# Altium schematic sheet Transmitter.SchDoc
size B; SheetNumber: 1; SheetTotal: 8
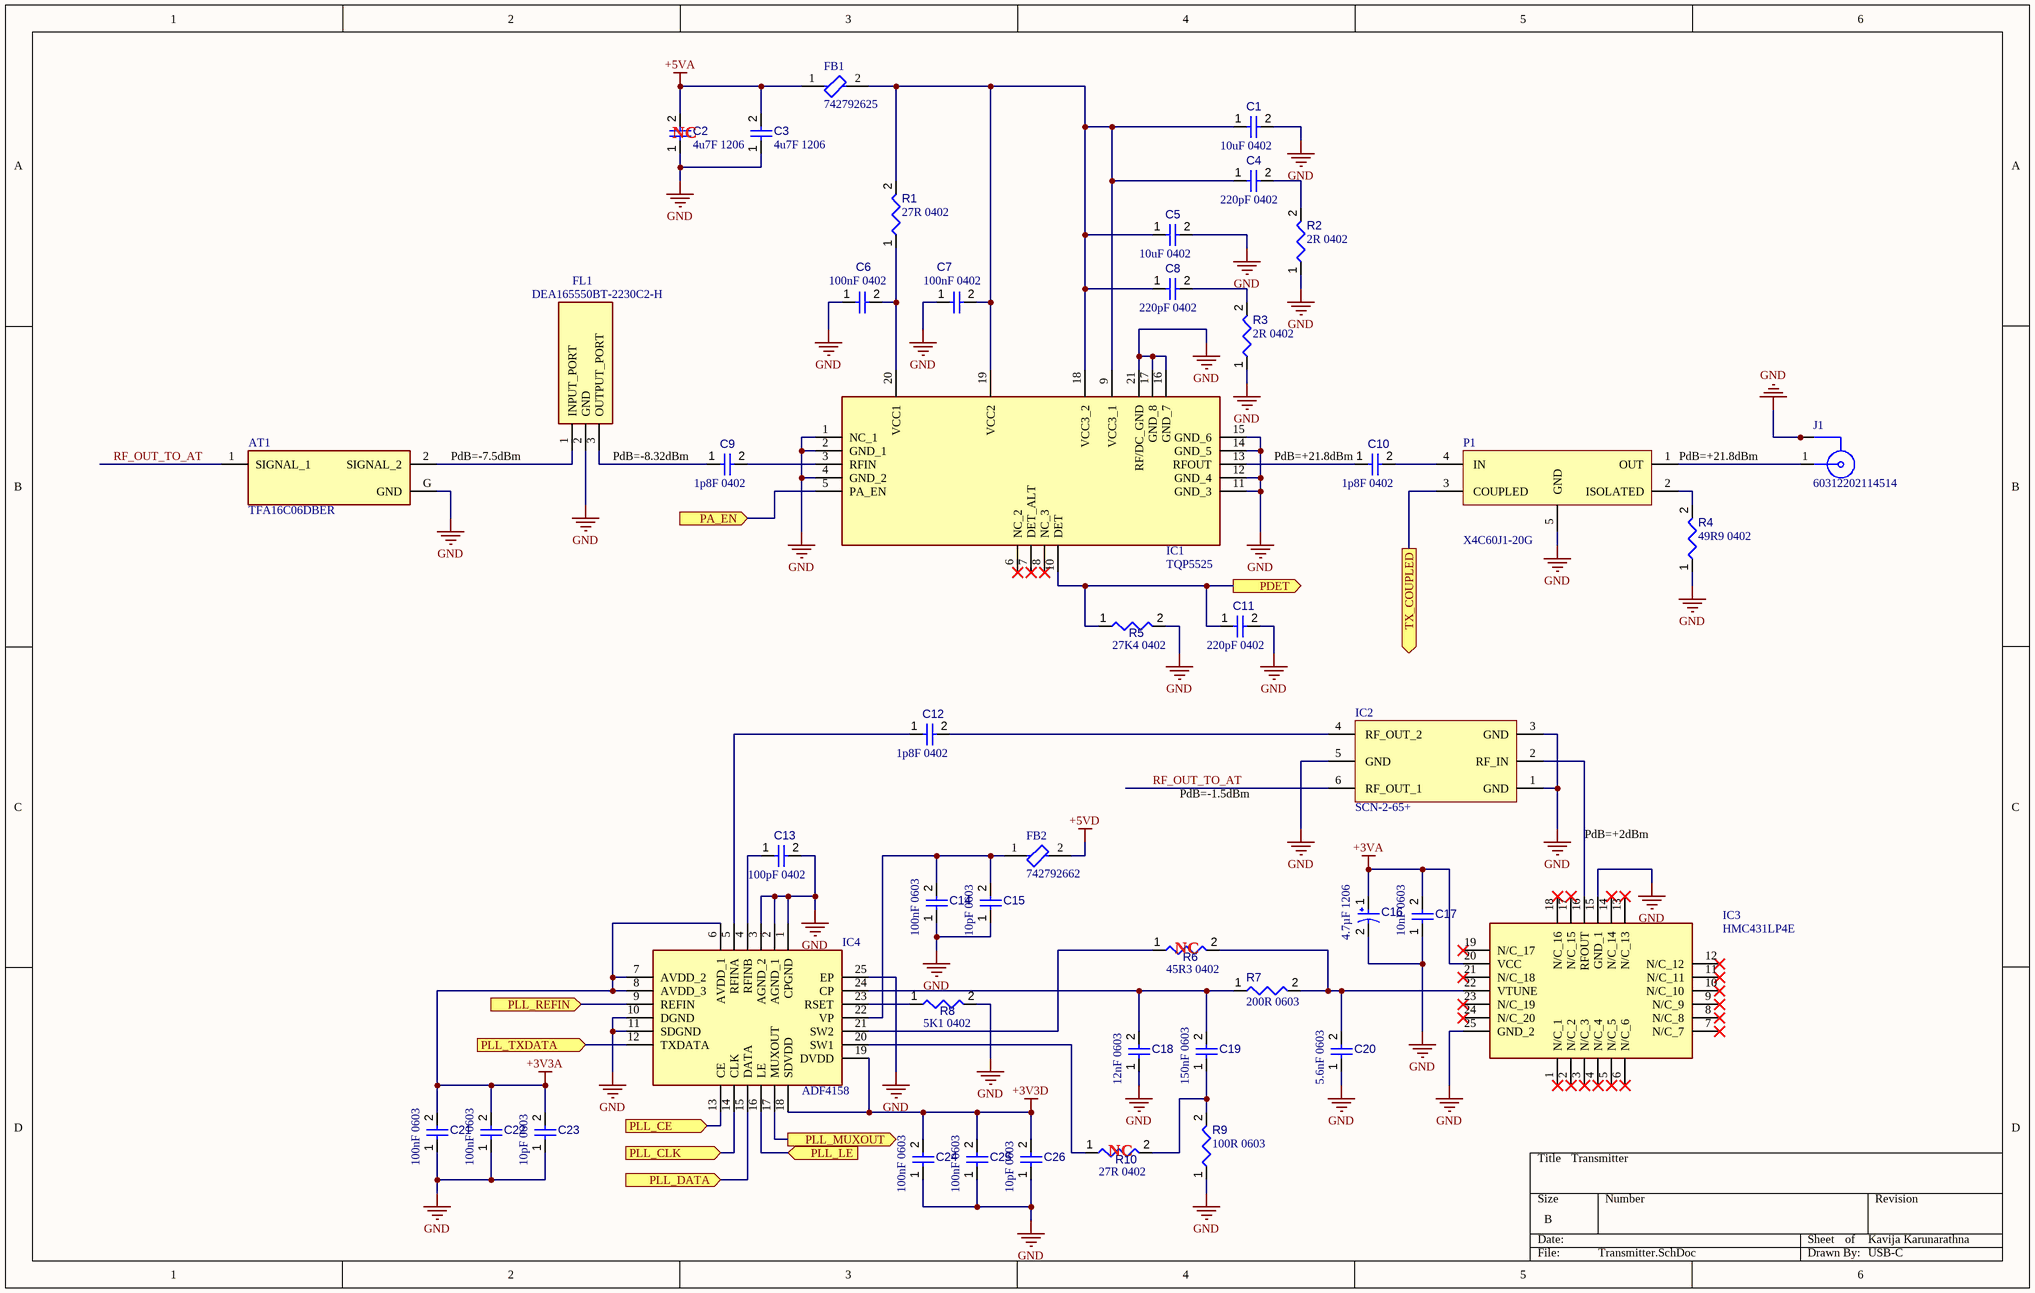
[diagram p0: Transmitter.SchDoc]

## Parts
AT1  TFA16C06DBER  [ATTN_TFA16C06DBER]
C1  value 10uF 0402  [CAPC0402(1005)60_L]  (hidden comment: Capacitor 10uF +/-10% 0402)
C2  value 4u7F 1206  [CAPC3216X180X50NL20T25]  (hidden comment: Capacitor 4.7 uF +/- 10% 60 V 1206)
C3  value 4u7F 1206  [CAPC3216X180X50NL20T25]  (hidden comment: Capacitor 4.7 uF +/- 10% 60 V 1206)
C4  value 220pF 0402  [CAPC0402(1005)60_L]  (hidden comment: Capacitor 220pF +/-10% 0402)
C5  value 10uF 0402  [CAPC0402(1005)60_L]  (hidden comment: Capacitor 10uF +/-10% 0402)
C6  value 100nF 0402  [CAPC0402(1005)60_L]  (hidden comment: Capacitor 100nF +/-10% 0402)
C7  value 100nF 0402  [CAPC0402(1005)60_L]  (hidden comment: Capacitor 100nF +/-10% 0402)
C8  value 220pF 0402  [CAPC0402(1005)60_L]  (hidden comment: Capacitor 220pF +/-10% 0402)
C9  value 1p8F 0402  [CAPC0402(1005)60_L]  (hidden comment: Capacitor 47nF +/-20% 50V 0402)
C10  value 1p8F 0402  [CAPC0402(1005)60_L]  (hidden comment: Capacitor 47nF +/-20% 50V 0402)
C11  value 220pF 0402  [CAPC0402(1005)60_L]  (hidden comment: Capacitor 220pF +/-10% 0402)
C12  value 1p8F 0402  [CAPC0402(1005)60_L]  (hidden comment: Capacitor 47nF +/-20% 50V 0402)
C13  value 100pF 0402  [CAPC0402(1005)60_L]  (hidden comment: Capacitor 47nF +/-20% 50V 0402)
C14  value 100nF 0603  [CAPC0603(1608)100_L]  (hidden comment: Capacitor 1µF +/-0.1% 25V 0603)
C15  value 10pF 0603  [CAPC0603(1608)100_L]  (hidden comment: Capacitor 1µF +/-0.1% 25V 0603)
C16  value 4.7µF 1206  [AVX-TAJ-A-2_L]  (hidden comment: TAJA475K016RNJ)
C17  value 10nF 0603  [CAPC0603(1608)100_L]  (hidden comment: Capacitor 1µF +/-0.1% 25V 0603)
C18  value 12nF 0603  [CAPC0603(1608)100_L]  (hidden comment: Capacitor 12nF +/-1% 0603)
C19  value 150nF 0603  [CAPC0603(1608)100_L]  (hidden comment: Capacitor 150nF +/-5% 25V 0603)
C20  value 5.6nF 0603  [CAPC0603(1608)100_L]  (hidden comment: Capacitor 1µF +/-0.1% 25V 0603)
C21  value 100nF 0603  [CAPC0603(1608)100_L]  (hidden comment: Capacitor 1µF +/-0.1% 25V 0603)
C22  value 100nF 0603  [CAPC0603(1608)100_L]  (hidden comment: Capacitor 1µF +/-0.1% 25V 0603)
C23  value 10pF 0603  [CAPC0603(1608)100_L]  (hidden comment: Capacitor 1µF +/-0.1% 25V 0603)
C24  value 100nF 0603  [CAPC0603(1608)100_L]  (hidden comment: Capacitor 1µF +/-0.1% 25V 0603)
C25  value 100nF 0603  [CAPC0603(1608)100_L]  (hidden comment: Capacitor 1µF +/-0.1% 25V 0603)
C26  value 10pF 0603  [CAPC0603(1608)100_L]  (hidden comment: Capacitor 1µF +/-0.1% 25V 0603)
FB1  742792625  [FB-0603]
FB2  742792662  [FB-0603]
FL1  DEA165550BT-2230C2-H  [DEA165550BT-2230C2-H]
IC1  TQP5525  [QPA9501TR13]
IC2  SCN-2-65+  [SCN-2-65+]
IC3  HMC431LP4E  [QFN50P400X400X100-25N]
IC4  ADF4158  [QFN50P400X400X80-25N-D]
J1  60312202114514  [60312202114514]
P1  X4C60J1-20G  [X4C60J1-20G]
R1  value 27R 0402  [RESC0402(1005)_L]  (hidden comment: 383KR2F)
R2  value 2R 0402  [RESC0402(1005)_L]  (hidden comment: 383KR2F)
R3  value 2R 0402  [RESC0402(1005)_L]  (hidden comment: 383KR2F)
R4  value 49R9 0402  [RESC0402(1005)_L]  (hidden comment: 383KR2F)
R5  value 27K4 0402  [RESC0402(1005)_L]  (hidden comment: 383KR2F)
R6  value 45R3 0402  [RESC0402(1005)_L]  (hidden comment: 383KR2F)
R7  value 200R 0603  [RESC0603(1608)_L]  (hidden comment: 120R3J)
R8  value 5K1 0402  [RESC0402(1005)_L]  (hidden comment: 383KR2F)
R9  value 100R 0603  [RESC0603(1608)_L]  (hidden comment: 120R3J)
R10  value 27R 0402  [RESC0402(1005)_L]  (hidden comment: 383KR2F)

## Ports
PA_EN (in, see MCU[3A]), PDET (out, see MCU[3C]), PLL_CE (in, see MCU[3A]), PLL_CLK (in, see MCU[2B]), PLL_DATA (in, see MCU[2B]), PLL_LE (in, see MCU[2C]), PLL_MUXOUT (out, see MCU[2B]), PLL_REFIN (in, see MCU[3D]), PLL_TXDATA (in, see MCU[2C]), TX_COUPLED (out, see Mixer[1C])

## Nets
+3V3A: C21.2 C22.2 C23.2 IC4.6(AVDD_1) IC4.7(AVDD_2) IC4.8(AVDD_3)
+3V3D: C24.2 C25.2 C26.2 IC4.18(SDVDD) IC4.19(DVDD)
+3VA: C16.1 C17.2 IC3.20(VCC)
+5VA: C2.2 C3.2 FB1.1
+5VD: FB2.2
GND: AT1.G(GND) C1.2 C2.1 C3.1 C5.2 C6.1 C7.1 C11.2 C13.2 C14.1 C15.1 C16.2 C17.1 C18.1 C20.1 C21.1 C22.1 C23.1 C24.1 C25.1 C26.1 FL1.2(GND) IC1.1(NC_1) IC1.2(GND_1) IC1.4(GND_2) IC1.11(GND_3) IC1.12(GND_4) IC1.14(GND_5) IC1.15(GND_6) IC1.16(GND_7) IC1.17(GND_8) IC1.21(RF/DC_GND) IC2.1(GND) IC2.3(GND) IC2.5(GND) IC3.15(GND_1) IC3.25(GND_2) IC4.1(CPGND) IC4.2(AGND_1) IC4.3(AGND_2) IC4.10(DGND) IC4.11(SDGND) IC4.25(EP) J1.2 J1.3 J1.4 J1.5 P1.5(GND) R2.1 R3.1 R4.1 R5.2 R8.2 R9.1
PA_EN: IC1.5(PA_EN) ; port PA_EN
PDET: C11.1 IC1.10(DET) R5.1 ; port PDET
PLL_CE: IC4.13(CE) ; port PLL_CE
PLL_CLK: IC4.14(CLK) ; port PLL_CLK
PLL_DATA: IC4.15(DATA) ; port PLL_DATA
PLL_LE: IC4.16(LE) ; port PLL_LE
PLL_MUXOUT: IC4.17(MUXOUT) ; port PLL_MUXOUT
PLL_REFIN: IC4.9(REFIN) ; port PLL_REFIN
PLL_TXDATA: IC4.12(TXDATA) ; port PLL_TXDATA
RF_OUT_TO_AT: AT1.1(SIGNAL_1) IC2.6(RF_OUT_1)
TX_COUPLED: P1.3(COUPLED) ; port TX_COUPLED
NetAT1_2: AT1.2(SIGNAL_2) FL1.1(INPUT_PORT)
NetC1_1: C1.1 C4.1 C5.1 C7.2 C8.1 FB1.2 IC1.9(VCC3_1) IC1.18(VCC3_2) IC1.19(VCC2) R1.2
NetC4_2: C4.2 R2.2
NetC6_2: C6.2 IC1.20(VCC1) R1.1
NetC8_2: C8.2 R3.2
NetC9_1: C9.1 FL1.3(OUTPUT_PORT)
NetC9_2: C9.2 IC1.3(RFIN)
NetC10_1: C10.1 IC1.13(RFOUT)
NetC10_2: C10.2 P1.4(IN)
NetC12_1: C12.1 IC4.5(RFINA)
NetC12_2: C12.2 IC2.4(RF_OUT_2)
NetC13_1: C13.1 IC4.4(RFINB)
NetC14_2: C14.2 C15.2 FB2.1 IC4.22(VP)
NetC18_2: C18.2 C19.2 IC4.24(CP) R7.1
NetC19_1: C19.1 R9.2 R10.2
NetC20_2: C20.2 IC3.22(VTUNE) R6.2 R7.2
NetIC2_2: IC2.2(RF_IN) IC3.16(RFOUT)
NetIC4_20: IC4.20(SW1) R10.1
NetIC4_21: IC4.21(SW2) R6.1
NetIC4_23: IC4.23(RSET) R8.1
NetJ1_1: J1.1 P1.1(OUT)
NetP1_2: P1.2(ISOLATED) R4.2

Not connected (* = marked no-connect by the designer): IC1 6(NC_2)* 7(DET_ALT)* 8(NC_3)*; IC3 1(N/C_1)* 2(N/C_2)* 3(N/C_3)* 4(N/C_4)* 5(N/C_5)* 6(N/C_6)* 7(N/C_7)* 8(N/C_8)* 9(N/C_9)* 10(N/C_10)* 11(N/C_11)* 12(N/C_12)* 13(N/C_13)* 14(N/C_14)* 17(N/C_15)* 18(N/C_16)* 19(N/C_17)* 21(N/C_18)* 23(N/C_19)* 24(N/C_20)*

## Notes on the sheet
- (near C2) NC
- PdB=-7.5dBm
- PdB=-8.32dBm
- (near C10) PdB=+21.8dBm
- (near P1) PdB=+21.8dBm
- PdB=-1.5dBm
- PdB=+2dBm
- (near R6) NC
- (near R10) NC
- Transmitter
- Kavija Karunarathna
- USB-C

## Library data of the parts
AT1 = CMP-379-000000-3: RF ATTENUATOR0603 RF ATTENUATOR; MF: Ohmite; Design Item ID: TFA16C06DBER; Value: *; Check_prices: https://www.snapeda.com/parts/TFA16C06DBER/Ohmite/view-part/?ref=eda; SnapEDA_Link: https://www.snapeda.com/parts/TFA16C06DBER/Ohmite/view-part/?ref=snap; Component Type: Standard; Package: None; Source: TFA16C06DBER.SchLib; Pin Count: 3; Manufacturer Part No: TFA16C06DBER; Mouser Part No: 588-TFA16C06DBER
C1 C5 = CMP-001-00071-4: Multilayer Ceramic Capacitors MLCC - SMD/SMT KGM05CR50G106MH NEW GLOBAL PN 4V 10uF X5 A 581-KGM05CR50G106MH; Manufacturer Part No: 04024D106MAT2A; Voltage Rating: 50V; Tolerance: 20%; Pins: 2; Mounting Technology: SMT; Case/Package: 0402; Max Operating Temperature: 85°C; Min Operating Temperature: -55°C; Mouser Part No: 581-04024D106MAT2A
C2 C3 = CMP-001-00016-6: Multilayer Ceramic Capacitors MLCC - SMD/SMT 50V 4.7uF X7R 1206 10% HI CV; Manufacturer Part No: CC1206KFX7R9BB475; Tolerance: 10%; Min Operating Temperature: -55°C; Capacitor Type: Ceramic; Voltage Rating: 50V; Pins: 2; Mounting Technology: SM; Case/Package: 1206; Max Operating Temperature: 125°C; RoHS Compliant: True; Mouser Part No: 603-CC1206KFX7R9B475
C4 C8 C11 = CMP-001-00071-4: Multilayer Ceramic Capacitors MLCC - SMD/SMT VJ 0402 C0G 221 0.1 Ni barrier 50V Unmarked 7" reel; Manufacturer Part No: VJ0402A221KXAAC; Tolerance: 20%; Pins: 2; Mounting Technology: SMT; Voltage Rating: 50V; Case/Package: 0402; Max Operating Temperature: 85°C; Min Operating Temperature: -55°C; Mouser Part No: 77-VJ0402A221KXAAC
C6 C7 = CMP-001-00071-4: Multilayer Ceramic Capacitors MLCC - SMD/SMT 25V .1uF X7R 0402 10 % -62C Storage Temp; Manufacturer Part No: 04023C104KAT2A-62; Voltage Rating: 50V; Tolerance: 20%; Pins: 2; Mounting Technology: SMT; Case/Package: 0402; Max Operating Temperature: 85°C; Min Operating Temperature: -55°C; Mouser Part No: 581-04023C104KAT2A62
C9 C10 C12 = CMP-001-00071-4: Multilayer Ceramic Capacitors MLCC - SMD/SMT 50 V 10 pF C0G 0402 1%; Manufacturer Part No: GJM1555C1H1R8CB01J; Tolerance: 20%; Pins: 2; Mounting Technology: SMT; Voltage Rating: 50V; Case/Package: 0402; Max Operating Temperature: 85°C; Min Operating Temperature: -55°C; Mouser Part No: 81-GJM1555C1H1R8CB1J
C13 = CMP-001-00071-4: Chip Capacitor, 47nF +/-20%, 50V, 0402, Thickness 0.6 mm; Manufacturer Part No: 0402X7R101KT2AT; Tolerance: 20%; Pins: 2; Mounting Technology: SMT; Voltage Rating: 50V; Case/Package: 0402; Max Operating Temperature: 85°C; Min Operating Temperature: -55°C; Mouser Part No: 581-0402X7R101KT2AT
C14 C21 C22 C24 C25 = CMP-001-00055-4: Chip Capacitor, 1µF +/-0.1%, 25V, 0603, Thickness 1 mm; Manufacturer Part No: 0603X104K250CT; Tolerance: 20%; Min Operating Temperature: -55°C; Max Operating Temperature: 85°C; Voltage Rating: 25V; Mounting Technology: SMT; Case/Package: 0603; Pins: 2; Mouser Part No: 791-0603X104K250CT
C15 C23 C26 = CMP-001-00055-4: Chip Capacitor, 1µF +/-0.1%, 25V, 0603, Thickness 1 mm; Manufacturer Part No: VJ0603A100JXBAP; Tolerance: 20%; Min Operating Temperature: -55°C; Max Operating Temperature: 85°C; Voltage Rating: 25V; Mounting Technology: SMT; Case/Package: 0603; Pins: 2; Mouser Part No: 77-VJ0603A100JXBAP
C16 = CMP-001-00042-7: Tantalum Capacitors - Solid SMD 20V 4.7uF 1206 10% ESR=4ohms; Manufacturer: AVX; Manufacturer Part No: T491A475K020AT; Resistance: 4Ohm; Voltage Rating: 16V; Max Operating Temperature: 125°C; Case/Package: 1206; Package Description: 2-Pin Surface Mount Device, Body 3.2 x 1.65 mm; Min Operating Temperature: -55°C; RoHS Compliant: True; Package Reference: TAJ-A-2; ESR: 4Ohm; Capacitor Type: Tantalum; Packaging: TapeandReel; Datasheet Version: Feb-16; Tolerance: 10%; Mounting Technology: SM; Package Quantity: 2000; Mouser Part No: 80-T491A475K020
C17 = CMP-001-00055-4: Multilayer Ceramic Capacitors MLCC - SMD/SMT 0603 10nF 16volts X7R 10%; Manufacturer Part No: VJ0603Y103KXJAC31X; Tolerance: 20%; Min Operating Temperature: -55°C; Max Operating Temperature: 85°C; Voltage Rating: 25V; Mounting Technology: SMT; Case/Package: 0603; Pins: 2; Mouser Part No: 77-V0603Y103KXJAC31X
C18 = CMP-001-00055-4: Multilayer Ceramic Capacitors MLCC - SMD/SMT Cap Cer 0603 12nF 16VDC X8G 1%; Manufacturer Part No: C0603C123F4TACTU; Tolerance: 20%; Voltage Rating: 25V; Min Operating Temperature: -55°C; Max Operating Temperature: 85°C; Mounting Technology: SMT; Case/Package: 0603; Pins: 2; Mouser Part No: 80-C0603C123F4TACTU
C19 = CMP-001-00055-4: Multilayer Ceramic Capacitors MLCC - SMD/SMT 10V .15uF X7R 0603 5 %; Manufacturer Part No: 0603ZC154JAT2A; Tolerance: 20%; Min Operating Temperature: -55°C; Max Operating Temperature: 85°C; Voltage Rating: 25V; Mounting Technology: SMT; Case/Package: 0603; Pins: 2; Mouser Part No: 581-0603ZC154JAT2A
C20 = CMP-001-00055-4: Chip Capacitor, 1µF +/-0.1%, 25V, 0603, Thickness 1 mm; Manufacturer Part No: 06033C562JAT2A; Tolerance: 20%; Min Operating Temperature: -55°C; Max Operating Temperature: 85°C; Voltage Rating: 25V; Mounting Technology: SMT; Case/Package: 0603; Pins: 2; Mouser Part No: 581-06033C562J
FB1 = 742792662-FB: FERRITE BEAD 0603; Max Current Rating: 2000mA; DC Resistance (DCR): 1000Ohm; Number of Lines: 1; Case/Package: 0603; Mount: Surface Mount; Case Code (Imperial): 0603; Packaging: Cut Tape; Max Operating Temperature: 125°C; Min Operating Temperature: -55°C; Manufacturer Part No: 742792625; Mouser Part No: 710-742792625
FB2 = 742792662-FB: FERRITE BEAD 0603; Max Current Rating: 600mA; DC Resistance (DCR): 1000Ohm; Number of Lines: 1; Case/Package: 0603; Mount: Surface Mount; Case Code (Imperial): 0603; Packaging: Cut Tape; Max Operating Temperature: 125°C; Min Operating Temperature: -55°C; Manufacturer Part No: 742792662; Mouser Part No: 710-742792662
FL1 = DEA165550BT-2230C2-H: Filter; Manufacturer_Name: TDK; Datasheet Link: https://product.tdk.com/system/files/dam/doc/product/rf/rf/filter/catalog/rf_bpf_dea165550bt-2322a1-h_en.pdf; Height: 0.65mm; Manufacturer Part No: DEA165550BT-2230C2-H; Mouser Price/Stock: https://www.mouser.co.uk/ProductDetail/TDK/DEA165550BT-2322A1-H?qs=t7xnP681wgVP2H2d%252Bwsz8A%3D%3D; Arrow Part Number: DEA165550BT-2322A1-H; Arrow Price/Stock: https://www.arrow.com/en/products/dea165550bt-2322a1-h/tdk?utm_currency=USD&region=nac; Mouser Part No: 810-DEA16555BT223C2H
IC1 = QPA9501TR13: Integrated Circuit; Manufacturer_Name: Qorvo; Datasheet Link: https://www.qorvo.com/products/d/da005897; Height: 0.9mm; Manufacturer Part No: TQP5525; Mouser Part No: 772-TQP5525; Mouser Price/Stock: https://www.mouser.co.uk/ProductDetail/Qorvo/QPA9501TR13?qs=l%2FgYmo23PNM7tJLHqC3zeA%3D%3D
IC2 = SCN-2-65+: Integrated Circuit; Manufacturer_Name: Mini-Circuits; Height: 0.96mm; Manufacturer Part No: SCN-2-65+; Mouser Part No: 139-SCN-2-65; Mouser Price/Stock: https://www.mouser.co.uk/ProductDetail/Mini-Circuits/QCN-45%2b?qs=xZ%2FP%252Ba9zWqYwP22V1vu4wA%3D%3D
IC3 = HMC431LP4E: Integrated Circuit; Manufacturer_Name: Analog Devices; Datasheet Link: https://www.analog.com/media/en/technical-documentation/data-sheets/hmc431.pdf; Height: 1mm; Manufacturer Part No: HMC431LP4E; Mouser Part No: 584-HMC431LP4E; Mouser Price/Stock: https://www.mouser.co.uk/ProductDetail/Analog-Devices/HMC431LP4E?qs=3izLlwrMQ7koKJkU3m2Tkw%3D%3D; Arrow Part Number: HMC431LP4E; Arrow Price/Stock: https://www.arrow.com/en/products/hmc431lp4e/analog-devices?region=europe
IC4 = ADF4158CCPZ-RL7: Integrated Circuit; Manufacturer_Name: Analog Devices; Datasheet Link: http://componentsearchengine.com/Datasheets/1/ADF4158CCPZ-RL7.pdf; Height: 0.8mm; Manufacturer Part No: ADF4158CCPZ-RL7; Mouser Part No: 584-ADF4158CCPZ; Mouser Price/Stock: https://www.mouser.co.uk/ProductDetail/Analog-Devices/ADF4158CCPZ-RL7?qs=BpaRKvA4VqEwT1bDzGawgQ%3D%3D; Arrow Part Number: ADF4158CCPZ-RL7; Arrow Price/Stock: https://www.arrow.com/en/products/adf4158ccpz-rl7/analog-devices?utm_currency=USD&region=nac
J1 = CMP-381-000000-3: MF: {'manufacturer': u'W\xfcrth Elektronik'}; Package: None; Component Type: Standard; Pin Count: 5; Value: *; Availability: Unavailable; Design Item ID: 60312202114514; Price: None; Source: 60312202114514.SchLib; Mouser Part No: 710-60312202114514; Manufacturer Part No: 60312202114514
R1 = CMP-009-00097-2: Thick Film Resistors - SMD 1/10 Watt 5.1Kohms 1%; Manufacturer Part No: CRCW040227R0JNED; Power: 100mW; Tolerance: 1%; Case/Package: 0402; Mounting Technology: SMT; Pins: 2; Mouser Part No: 71-CRCW0402J-27-E3
R2 R3 = CMP-009-00097-2: Thick Film Resistors - SMD 2 Ohms 50 V 200 mW (1/5 W) 1 mmx0.5 mmx0.35 mm - 55 C+ 155 C; Manufacturer Part No: ERJ-PA2J2R0X; Tolerance: 1%; Power: 100mW; Case/Package: 0402; Mounting Technology: SMT; Pins: 2; Mouser Part No: 667-ERJ-PA2J2R0X
R4 = CMP-009-00097-2: Thin Film Resistors - SMD 49.9 OHM .1% 50PPM 1/16W; Manufacturer Part No: RT0402BRE0749R9L; Tolerance: 1%; Power: 100mW; Case/Package: 0402; Mounting Technology: SMT; Pins: 2; Mouser Part No: 603-RT0402BRE0749R9L
R5 = CMP-009-00097-2: Thin Film Resistors - SMD 0402 0.1% 15ppm 27.4Kohm AEC-Q200; Manufacturer Part No: ERA-2VPB2742X; Tolerance: 1%; Power: 100mW; Case/Package: 0402; Mounting Technology: SMT; Pins: 2; Mouser Part No: 667-ERA-2VPB2742X
R6 = CMP-009-00097-2: Thick Film Resistors - SMD 1/10 Watt 5.1Kohms 1%; Manufacturer Part No: CRCW040245R3FKEDC; Power: 100mW; Tolerance: 1%; Case/Package: 0402; Mounting Technology: SMT; Pins: 2; Mouser Part No: 71-CRCW040245R3FKEDC
R7 = CMP-009-00069-2: Thick Film Resistors - SMD General Purpose Chip Resistor 0603, 200Ohms, 1%, 1/10W; Manufacturer Part No: RC0603FR-10200RL; Power: 100mW; Tolerance: 5%; Mounting Technology: SMT; Case/Package: 0603; Pins: 2; Mouser Part No: 603-RC0603FR-10200RL
R8 = CMP-009-00097-2: Thick Film Resistors - SMD 1/10 Watt 5.1Kohms 1%; Manufacturer Part No: CRCW04025K10FKED; Power: 100mW; Tolerance: 1%; Case/Package: 0402; Mounting Technology: SMT; Pins: 2; Mouser Part No: 71-CRCW0402-5.1K-E3
R9 = CMP-009-00069-2: Thick Film Resistors - SMD WRIS-RSKS 100 Ohms 1 % 0.1 W 0603 AEC-Q200; Manufacturer Part No: 560112116009; Power: 100mW; Tolerance: 5%; Mounting Technology: SMT; Case/Package: 0603; Pins: 2; Mouser Part No: 710-560112116009
R10 = CMP-009-00097-2: Thick Film Resistors - SMD 1/10 Watt 5.1Kohms 1%; Manufacturer Part No: CRCW040227R0JNTD; Power: 100mW; Tolerance: 1%; Case/Package: 0402; Mounting Technology: SMT; Pins: 2; Mouser Part No: 71-CRCW0402J-27
P1 = X4C60J1-20G: Manufacturer Part No: X4C60J1-20G; Mouser Part No: 620-X4C60J1-20G